# Altium schematic sheet VOLTAGEINDICATOR23-ESF.SchDoc
size 139 x 101 mm
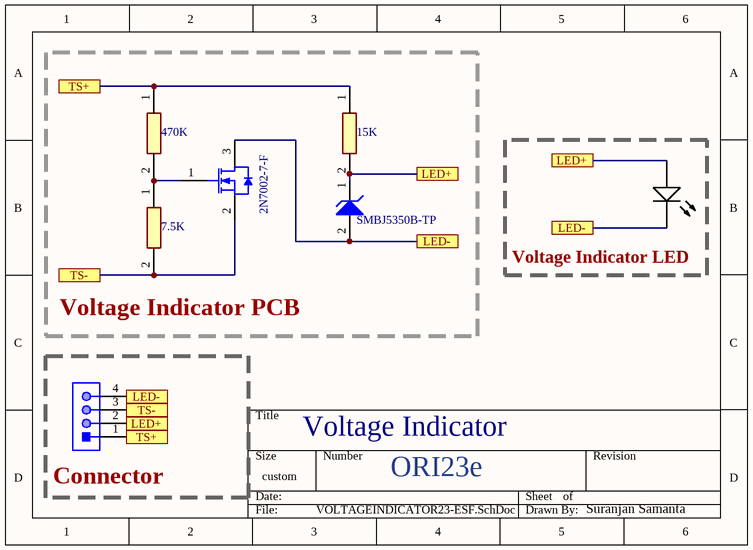
[diagram p0: VOLTAGEINDICATOR23-ESF.SchDoc]

## Parts
(Parts that share a designator on the sheet are numbered #1, #2 ... from top to bottom, then left to right.)
?  WURTH LED  [AVAG-HSMW-C191_V]  (value not drawn)
D?  SMBJ5350B-TP  [ONSC-SOD-123-2-425-04_V]
P?  662304131822  [662304131822]  (value not drawn)
Q?  2N7002-7-F  [FAIR-SOT-3_V]
R?#1  470K  [RESC3126X60N]
R?#2  15K  [RESC3126X60N]
R?#3  7.5K  [RESC3126X60N]

## Blocks framed on the sheet
Voltage Indicator PCB: D? Q? R?#1-R?#3
Voltage Indicator LED: ?
Connector: P?

## Ports
LED+, LED-, TS+, TS-

## Nets
LED+: ?.1(A) D?.1(K) P?.2 R?#2.2 ; port LED+
LED-: ?.2(K) D?.2(A) P?.4 Q?.3(D) ; port LED-
TS+: P?.1 R?#1.1 R?#2.1 ; port TS+
TS-: P?.3 Q?.2(S) R?#3.2 ; port TS-
NetQ?_1: Q?.1(G) R?#1.2 R?#3.1

## Notes on the sheet
- Voltage Indicator
- ORI23e
- Suranjan Samanta

## Library data of the parts
? = CMP-1744-00001-1: LED Uni-Color White, 78 mW, 20 mA, -40 to 85 degC, 2-Pin SMD, RoHS, Tape and Reel; Current Rating: 300 mA; Contact Plating: Silver; Width: 12 mm; Package Quantity: 560; ComponentLink2URL: http://docs.avagotech.com/docs/AV02-0186EN; ComponentLink1URL: http://www.avagotech.com/; RoHSCompliant: true; PackageDescription: 2-Pin Surface Mount Device, Body 1.6 x 0.8 mm; Contact Material: Copper; ComponentLink1Description: Manufacturer URL; Mount: Through Hole; Packaging: Bulk; DatasheetVersion: May-10; Height: 12 mm; ComponentLink2Description: Datasheet; Contact Finish: Silver; Max Operating Temperature: 85 degC; Radiation Hardening: No; PackageReference: HSMW-C191; REACH SVHC: Unknown; Min Operating Temperature: -20 degC; Length: 16 mm
D? = CMP-1060-00318-1: Zener Voltage Regulator, 500 mW, 2-Pin SOD-123, Pb-Free, Tape and Reel; Manufacturer: On Semiconductor; PartNumber: MMSZ4713T1G; P Max (W): 0.5; VZ Typ (V): 30; PackageVersion: Rev. G, 10/2009; Mounting Technology: Surface Mount; ComponentLink3URL: http://www.onsemi.com/pub_link/Collateral/425-04.PDF; ComponentLink3Description: Package Specification; ComponentLink1Description: Manufacturer URL; PackageReference: SOD-123-2-425-04; ComponentLink2Description: Datasheet; DatasheetVersion: Rev. 9; RoHS: Pb-Free; Packing: Tape and Reel; ComponentLink2URL: http://www.onsemi.com/pub_link/Collateral/MMSZ4678T1-D.PDF; ComponentLink1URL: http://www.onsemi.com/; PackageDescription: 2-Pin SOD, Body 1.6 x 2.69 mm
P? = CMP-1502-00458-1: SMT Male Header WR-MPC3, with SMT Solder Tabs, Vertical, Single Row, pitch 3 mm, 4 pins; Manufacturer: Wurth Elektronik; Working Voltage: 250VAC; Pitch: 3mm; Pin Number: 4; Contact Resistance: 10mOhm; Mounting Technology: SMT; Manufacturer URL: http://www.we-online.de; Publisher: WurthElektronik; Operating Temperature: -40to105degC; Gender: Male; Packaging: TapeandReel; Orientation: Vertical; Datasheet URL: https://katalog.we-online.de/em/datasheet/6623xx131822.pdf; Package Reference: 662304131822; Part Number: 662304131822
Q? = CMP-2000-06834-1: N-Channel Logic Level Enhancement Mode Field Effect Transistor, 30 V, 1.7 A, -55 to150 degC, 3-Pin SOT-3, RoHS, Tape and Reel; Manufacturer: FairchildSemiconductor; Maximum Drain Source Voltage: 30V; RDS-on: 85@10VmOhm; Typical Fall Time: 5ns; Typical Rise Time: 32ns; Typical Turn-On Delay Time: 10ns; Channel Type: N; Typical Turn-Off Delay Time: 13ns; Maximum Gate Source Voltage: ±20V; Maximum Continuous Drain Current: 1.7A; Package URL: https://www.fairchildsemi.com/package-drawings/MA/MA03B.pdf; Packaging: Tape&Reel; Category: MOSFET; Mounting Technology: SurfaceMount; Datasheet Version: 01/1997; Datasheet URL: https://www.fairchildsemi.com/datasheets/ND/NDS355AN.pdf; Channel Mode: Enhancement; Package Description: 3-Pin Small Outline Transistor, Body 2.92 x 1.4 mm, Pitch 0.95 mm; Package: 3SuperSOT; Operating Temperature: -55to150°C; Package Reference: SOT-3; Manufacturer URL: https://www.fairchildsemi.com/; Mounting: SurfaceMount
R?#1-R?#3 = RC1210JR-0710KL: Resistor; Manufacturer_Name: YAGEO (PHYCOMP); Datasheet Link: http://www.yageo.com/documents/recent/PYu-RC1210_51_RoHS_L_(4).pdf; Height: 0.6mm; Manufacturer_Part_Number: RC1210JR-0710KL; Mouser Part Number: 603-RC1210JR-0710KL; Mouser Price/Stock: https://www.mouser.com/Search/Refine.aspx?Keyword=603-RC1210JR-0710KL